# EasyEDA Pro project Drone.eprj, schematic Schematic1, sheet 1 of 9

## Sheets
1 SoC: Board Name: Board1; Create Date: 2025-04-25; Page Name: SoC; Project Name: Drone; Schematic Name: Schematic1; Update Date: 2025-08-30; Company: 嘉立创EDA; Page Size: A4; Version: V1.0
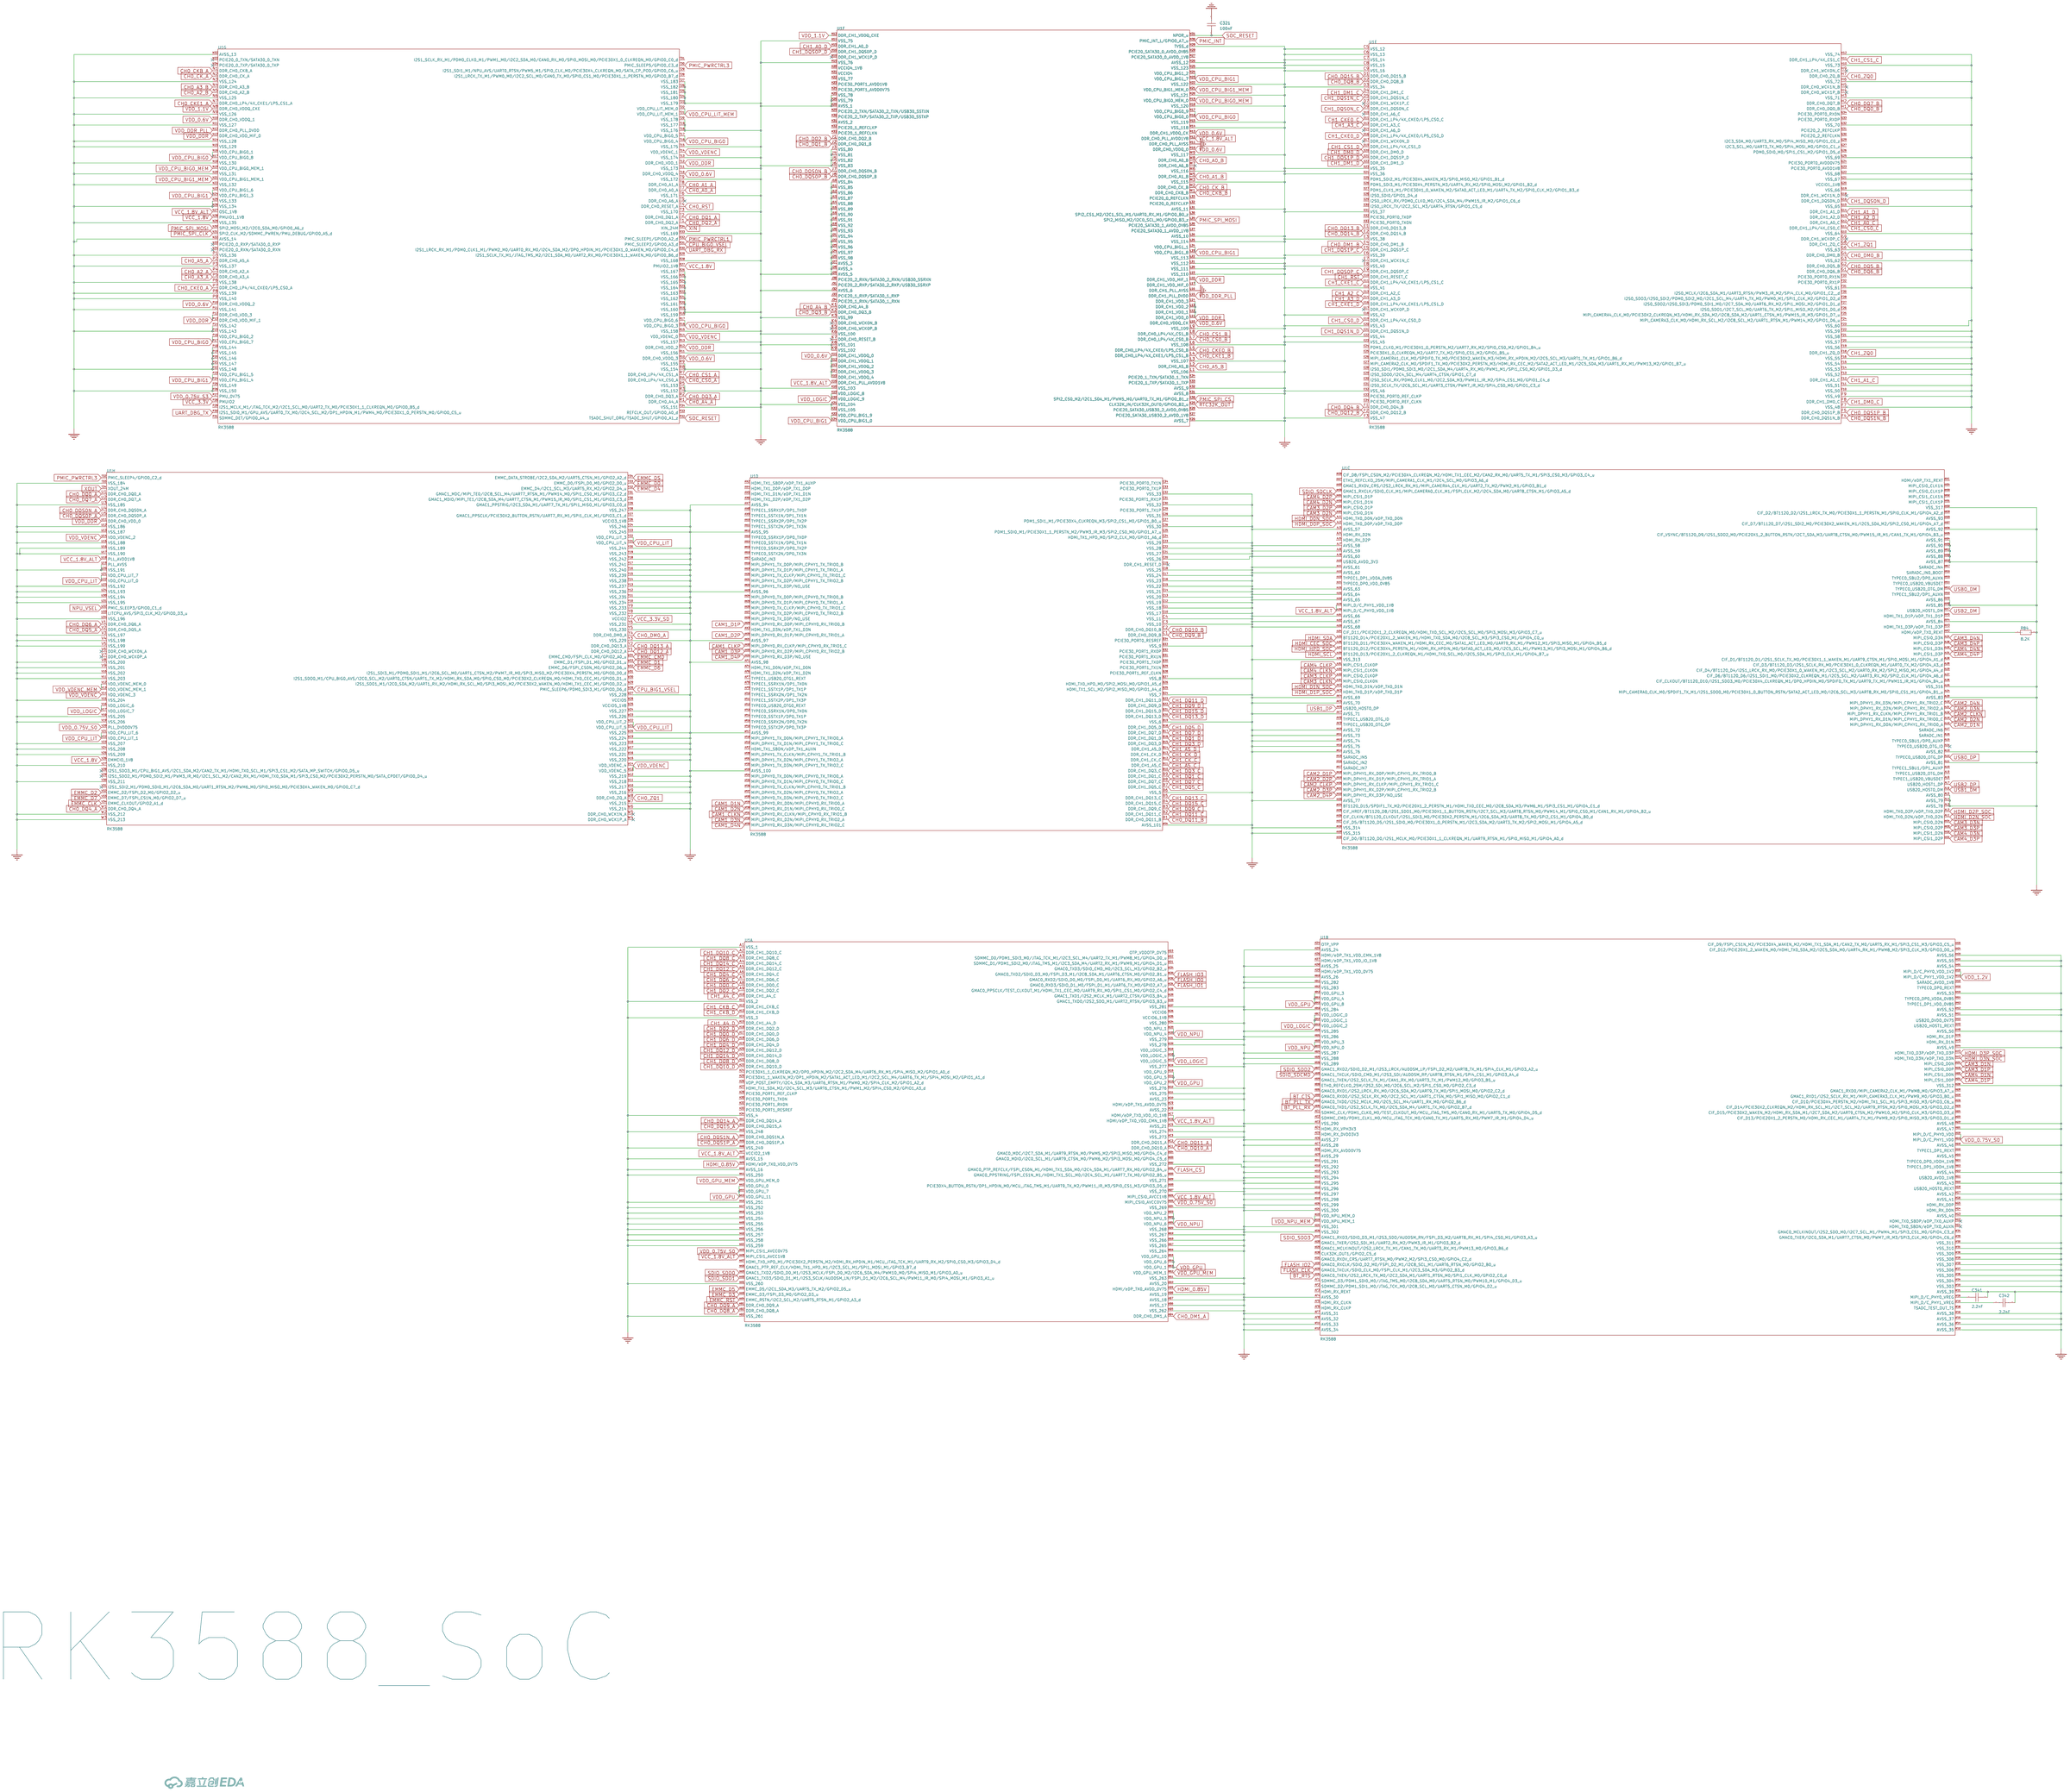
[diagram p0: SoC]

## Parts
C321  100nF  [C0201]
C341  2.2nF  [C0201]
C342  2.2nF  [C0201]
R84  8.2K  [R0603]
U1  RK3588  [FCBGA-1088_L23.0-W23.0-P0.65-TL_RK3588]  (sections 1,2,3,4,5,6,7,8)

## Library data of the parts
C321 = GRM033R61E104KE14D: LCSC Part Name: 100nF ±10% 25V; Supplier Part: C76939; Manufacturer: muRata(村田); Supplier Footprint: 0201; JLCPCB Part Class: Extended Part; Datasheet: https://atta.szlcsc.com/upload/public/pdf/source/20180307/C76939_15204091018551407727.pdf; Supplier: LCSC; Tolerance: ±10%; Voltage Rating: 25V; Temperature Coefficient: X5R
C341 C342 = CGA0201X7R222K500ET: LCSC Part Name: 2.2nF ±10% 50V; Supplier Part: C36911340; Manufacturer: HRE(芯声); Supplier Footprint: 0201; JLCPCB Part Class: Extended Part; Datasheet: https://atta.szlcsc.com/upload/public/pdf/source/20240730/354D3134AC94A21D1BE6B583FF1630D9.pdf; Supplier: LCSC; Tolerance: ±10%; Voltage Rating: 50V; Temperature Coefficient: X7R
R84 = Res_0603: Supplier Footprint: 0603
U1 = RK3588_C5156490: Supplier Part: C5156490; Manufacturer: Rockchip(瑞芯微); Supplier Footprint: BGA-1088; JLCPCB Part Class: 扩展库; Datasheet: https://atta.szlcsc.com/upload/public/pdf/source/20230904/073C391AB0E7106E056B3401F034E8E7.pdf; Supplier: LCSC

## Nets
GND: C321.2 C341.2 C342.2 R84.2 U1.A1(VSS_1) U1.A11(VSS_2) U1.A14(VSS_3) U1.A34(VSS_4) U1.AA3(VSS_248) U1.AA6(VSS_249) U1.AA8(AVSS_15) U1.AA10(AVSS_16) U1.AA11(VSS_250) U1.AA16(VSS_251) U1.AA17(VSS_252) U1.AA18(VSS_253) U1.AA19(VSS_254) U1.AA20(VSS_255) U1.AA21(VSS_256) U1.AA22(VSS_257) U1.AA23(VSS_258) U1.AA24(VSS_259) U1.AA31(VSS_260) U1.AB3(VSS_261) U1.AB5(VSS_262) U1.AB6(AVSS_17) U1.AB7(AVSS_18) U1.AB8(AVSS_19) U1.AB10(AVSS_20) U1.AB11(VSS_263) U1.AB16(VSS_264) U1.AB17(VSS_265) U1.AB18(VSS_266) U1.AB19(VSS_267) U1.AB20(VSS_268) U1.AB24(VSS_269) U1.AB27(VSS_270) U1.AB29(VSS_271) U1.AB32(VSS_272) U1.AC3(VSS_273) U1.AC4(VSS_274) U1.AC5(AVSS_21) U1.AC8(AVSS_22) U1.AC10(AVSS_23) U1.AC11(VSS_275) U1.AC12(VSS_276) U1.AC16(VSS_277) U1.AC20(VSS_278) U1.AC21(VSS_279) U1.AC24(VSS_280) U1.AC27(VSS_281) U1.AD5(AVSS_24) U1.AD8(AVSS_25) U1.AD10(AVSS_26) U1.AD11(VSS_282) U1.AD12(VSS_283) U1.AD16(VSS_284) U1.AD20(VSS_285) U1.AD21(VSS_286) U1.AD24(VSS_287) U1.AD25(VSS_288) U1.AD26(VSS_289) U1.AE3(VSS_290) U1.AE6(AVSS_27) U1.AE7(AVSS_28) U1.AE9(AVSS_29) U1.AE11(VSS_291) U1.AE12(VSS_292) U1.AE13(VSS_293) U1.AE14(VSS_294) U1.AE15(VSS_295) U1.AE16(VSS_296) U1.AE18(VSS_297) U1.AE19(VSS_298) U1.AE20(VSS_299) U1.AE21(VSS_300) U1.AE24(VSS_301) U1.AE26(VSS_302) U1.AF4(AVSS_30) U1.AF7(AVSS_31) U1.AF8(AVSS_32) U1.AF11(AVSS_33) U1.AF12(AVSS_34) U1.AF13(AVSS_35) U1.AF14(AVSS_36) U1.AF15(AVSS_37) U1.AF16(AVSS_38) U1.AF21(AVSS_39) U1.AF22(VSS_303) U1.AF24(VSS_304) U1.AF25(VSS_305) U1.AF27(VSS_306) U1.AF28(VSS_307) U1.AF29(VSS_308) U1.AF30(VSS_309) U1.AF31(VSS_310) U1.AF32(VSS_311) U1.AG3(AVSS_40) U1.AG6(AVSS_41) U1.AG7(AVSS_42) U1.AG10(AVSS_43) U1.AG12(AVSS_44) U1.AG18(AVSS_46) U1.AG21(AVSS_47) U1.AG22(AVSS_48) U1.AG30(VSS_312) U1.AH4(AVSS_49) U1.AH8(AVSS_50) U1.AH11(AVSS_51) U1.AH12(AVSS_52) U1.AH15(AVSS_53) U1.AH21(AVSS_54) U1.AH22(AVSS_55) U1.AH23(AVSS_56) U1.AJ3(AVSS_57) U1.AJ7(AVSS_58) U1.AJ8(AVSS_59) U1.AJ9(AVSS_60) U1.AJ11(AVSS_61) U1.AJ12(AVSS_62) U1.AJ15(AVSS_63) U1.AJ16(AVSS_64) U1.AJ18(AVSS_65) U1.AJ21(AVSS_66) U1.AJ22(AVSS_67) U1.AJ23(AVSS_68) U1.AJ30(VSS_313) U1.AK4(AVSS_69) U1.AK5(AVSS_70) U1.AK7(AVSS_71) U1.AK10(AVSS_72) U1.AK11(AVSS_73) U1.AK12(AVSS_74) U1.AK13(AVSS_75) U1.AK14(AVSS_76) U1.AK23(AVSS_77) U1.AK28(VSS_314) U1.AK29(VSS_315) U1.AL3(AVSS_78) U1.AL4(AVSS_79) U1.AL5(AVSS_80) U1.AL11(AVSS_81) U1.AL13(AVSS_82) U1.AL23(AVSS_83) U1.AL25(VSS_316) U1.AM4(AVSS_84) U1.AM8(AVSS_85) U1.AM9(AVSS_86) U1.AM18(AVSS_87) U1.AM20(AVSS_88) U1.AM22(AVSS_89) U1.AM23(AVSS_90) U1.AM24(AVSS_91) U1.AM26(AVSS_92) U1.AM30(VSS_317) U1.AN7(AVSS_94) U1.AN12(AVSS_95) U1.AN23(AVSS_96) U1.AN31(AVSS_97) U1.AP1(AVSS_98) U1.AP17(AVSS_99) U1.AP23(AVSS_100) U1.AP34(AVSS_101) U1.B6(VSS_5) U1.B19(VSS_6) U1.B24(VSS_7) U1.B27(VSS_8) U1.B33(VSS_9) U1.C3(VSS_10) U1.C4(VSS_11) U1.C5(VSS_12) U1.C6(VSS_13) U1.C7(VSS_14) U1.C8(VSS_15) U1.C9(VSS_16) U1.C10(VSS_17) U1.C11(VSS_18) U1.C12(VSS_19) U1.C13(VSS_20) U1.C14(VSS_21) U1.C15(VSS_22) U1.C16(VSS_23) U1.C17(VSS_24) U1.C18(VSS_25) U1.C20(VSS_26) U1.C21(VSS_27) U1.C22(VSS_28) U1.C23(VSS_29) U1.C26(VSS_30) U1.C28(VSS_31) U1.C30(VSS_32) U1.C32(VSS_33) U1.D3(VSS_34) U1.D23(VSS_35) U1.D24(VSS_36) U1.D31(VSS_37) U1.E3(VSS_38) U1.E6(VSS_39) U1.E8(VSS_40) U1.E12(VSS_41) U1.E18(VSS_42) U1.E20(VSS_43) U1.E22(VSS_44) U1.E23(VSS_45) U1.E32(VSS_46) U1.F3(VSS_47) U1.F7(VSS_48) U1.F9(VSS_49) U1.F10(VSS_50) U1.F11(VSS_51) U1.F13(VSS_52) U1.F14(VSS_53) U1.F15(VSS_54) U1.F16(VSS_55) U1.F19(VSS_56) U1.F20(VSS_57) U1.F21(VSS_58) U1.F22(VSS_59) U1.F23(VSS_60) U1.F31(VSS_61) U1.G3(VSS_62) U1.G6(VSS_63) U1.G10(VSS_64) U1.G15(VSS_65) U1.G19(VSS_66) U1.G21(VSS_67) U1.G22(VSS_68) U1.G25(VSS_69) U1.G32(VSS_70) U1.H3(VSS_71) U1.H6(VSS_72) U1.H10(VSS_73) U1.H12(VSS_74) U1.H14(VSS_75) U1.H19(VSS_76) U1.H25(VSS_78) U1.H26(VSS_79) U1.H28(AVSS_1) U1.J3(VSS_80) U1.J4(VSS_81) U1.J5(VSS_82) U1.J6(VSS_83) U1.J10(VSS_84) U1.J11(VSS_85) U1.J12(VSS_86) U1.J13(VSS_87) U1.J14(VSS_88) U1.J15(VSS_89) U1.J16(VSS_90) U1.J18(VSS_91) U1.J19(VSS_92) U1.J20(VSS_93) U1.J21(VSS_94) U1.J22(VSS_95) U1.J23(VSS_96) U1.J24(VSS_97) U1.J25(VSS_98) U1.J27(AVSS_3) U1.J28(AVSS_4) U1.J29(AVSS_5) U1.J32(AVSS_6) U1.K3(VSS_99) U1.K6(VSS_100) U1.K8(VSS_101) U1.K9(VSS_102) U1.K18(VSS_103) U1.K21(VSS_104) U1.K22(VSS_105) U1.K26(AVSS_7) U1.K31(AVSS_8) U1.K32(AVSS_9) U1.L1(VSS_106) U1.L3(VSS_107) U1.L6(VSS_108) U1.L9(VSS_109) U1.L16(DDR_CH1_PLL_AVSS) U1.L19(VSS_110) U1.L20(VSS_111) U1.L21(VSS_112) U1.L22(VSS_113) U1.L25(VSS_114) U1.L26(AVSS_10) U1.L31(AVSS_11) U1.M3(VSS_115) U1.M6(VSS_116) U1.M9(VSS_117) U1.M11(DDR_CH0_PLL_AVSS) U1.M14(VSS_118) U1.M15(VSS_119) U1.M18(VSS_120) U1.M20(VSS_121) U1.M22(VSS_122) U1.M25(VSS_123) U1.M26(AVSS_12) U1.M29(TVSS_d) U1.M32(AVSS_13) U1.N3(VSS_124) U1.N6(VSS_125) U1.N9(VSS_126) U1.N11(VSS_127) U1.N14(VSS_128) U1.N15(VSS_129) U1.N18(VSS_130) U1.N20(VSS_131) U1.N22(VSS_132) U1.N25(VSS_133) U1.N26(VSS_134) U1.N29(VSS_135) U1.N32(AVSS_14) U1.P1(VSS_136) U1.P3(VSS_137) U1.P6(VSS_138) U1.P8(VSS_139) U1.P9(VSS_140) U1.P11(VSS_141) U1.P14(VSS_142) U1.P15(VSS_143) U1.P18(VSS_144) U1.P19(VSS_145) U1.P20(VSS_146) U1.P21(VSS_147) U1.P22(VSS_148) U1.P25(VSS_149) U1.P26(VSS_150) U1.P34(VSS_151) U1.R3(VSS_152) U1.R5(VSS_153) U1.R8(VSS_154) U1.R9(VSS_155) U1.R11(VSS_156) U1.R13(VSS_157) U1.R15(VSS_158) U1.R18(VSS_159) U1.R19(VSS_160) U1.R20(VSS_161) U1.R21(VSS_162) U1.R22(VSS_163) U1.R23(VSS_164) U1.R24(VSS_165) U1.R25(VSS_166) U1.R26(VSS_167) U1.R28(VSS_168) U1.R33(VSS_169) U1.T3(VSS_170) U1.T6(VSS_171) U1.T9(VSS_172) U1.T11(VSS_173) U1.T13(VSS_174) U1.T15(VSS_175) U1.T18(VSS_176) U1.T19(VSS_177) U1.T20(VSS_178) U1.T23(VSS_179) U1.T24(VSS_180) U1.T25(VSS_181) U1.T26(VSS_182) U1.T27(VSS_183) U1.T33(VSS_184) U1.U3(VSS_185) U1.U12(VSS_186) U1.U13(VSS_187) U1.U15(VSS_188) U1.U16(VSS_189) U1.U17(VSS_190) U1.U19(PLL_AVSS) U1.U20(VSS_191) U1.U23(VSS_192) U1.U24(VSS_193) U1.U30(VSS_194) U1.U31(VSS_195) U1.U34(VSS_196) U1.V3(VSS_197) U1.V4(VSS_198) U1.V5(VSS_199) U1.V8(VSS_200) U1.V9(VSS_201) U1.V10(VSS_202) U1.V11(VSS_203) U1.V15(VSS_204) U1.V18(VSS_205) U1.V19(VSS_206) U1.V23(VSS_207) U1.V24(VSS_208) U1.V25(VSS_209) U1.V27(VSS_210) U1.V30(VSS_211) U1.W2(VSS_212) U1.W3(VSS_213) U1.W6(VSS_214) U1.W7(VSS_215) U1.W9(VSS_216) U1.W10(VSS_217) U1.W11(VSS_218) U1.W12(VSS_219) U1.W15(VSS_220) U1.W16(VSS_221) U1.W17(VSS_222) U1.W18(VSS_223) U1.W19(VSS_224) U1.W20(VSS_225) U1.W23(VSS_226) U1.W24(VSS_227) U1.W27(VSS_228) U1.Y3(VSS_229) U1.Y5(VSS_230) U1.Y6(VSS_231) U1.Y8(VSS_232) U1.Y9(VSS_233) U1.Y10(VSS_234) U1.Y11(VSS_235) U1.Y12(VSS_236) U1.Y13(VSS_237) U1.Y14(VSS_238) U1.Y15(VSS_239) U1.Y16(VSS_240) U1.Y17(VSS_241) U1.Y18(VSS_242) U1.Y19(VSS_243) U1.Y20(VSS_244) U1.Y23(VSS_245) U1.Y24(VSS_246) U1.Y28(VSS_247) ; also on sheet 2 3 4 5 6 7 8 9
VCC_1.8V: U1.N28(PMUIO1_1V8) U1.R27(PMUIO2_1V8) U1.V26(EMMCIO_1V8) ; also on sheet 2 4 5 6
VCC_1.8V_ALT: U1.AA7(VCCIO2_1V8) U1.AA26(MIPI_CSI1_AVCC1V8) U1.AB26(MIPI_CSI0_AVCC1V8) U1.AC6(HDMI/eDP_TX0_VDD_CMN_1V8) U1.AC7(HDMI/eDP_TX0_VDD_IO_1V8) U1.AJ19(MIPI_D/C_PHY1_VDD_1V8) U1.AJ20(MIPI_D/C_PHY0_VDD_1V8) U1.K16(DDR_CH1_PLL_AVDD1V8) U1.M12(DDR_CH0_PLL_AVDD1V8) U1.N27(OSC_1V8) U1.U18(PLL_AVDD1V8) ; also on sheet 4 5 9
VCC_3.3V: U1.P28(PMUIO2) ; also on sheet 2 4 7 8
VCC_3.3V_SD: U1.Y7(VCCIO2) ; also on sheet 4
VDD_0.6V: U1.K11(DDR_CH1_VDDQ_0) U1.K12(DDR_CH1_VDDQ_1) U1.K13(DDR_CH1_VDDQ_2) U1.K14(DDR_CH1_VDDQ_3) U1.K15(DDR_CH1_VDDQ_4) U1.L10(DDR_CH0_VDDQ_CK) U1.M10(DDR_CH0_VDDQ_0) U1.M13(DDR_CH1_VDDQ_CK) U1.N10(DDR_CH0_VDDQ_1) U1.P10(DDR_CH0_VDDQ_2) U1.R10(DDR_CH0_VDDQ_3) U1.T10(DDR_CH0_VDDQ_4) ; also on sheet 2 4 5
VDD_0.75V_S0: U1.AA25(MIPI_CSI1_AVCC0V75) U1.AB25(MIPI_CSI0_AVCC0V75) U1.AG19(MIPI_D/C_PHY1_VDD) U1.AG20(MIPI_D/C_PHY0_VDD) U1.V20(PLL_DVDD0V75) ; also on sheet 4 5
VDD_0.75V_S3: U1.P27(PMU_0V75) ; also on sheet 4 5
VDD_1.1V: U1.H13(DDR_CH1_VDDQ_CKE) U1.N8(DDR_CH0_VDDQ_CKE) ; also on sheet 2 4 5
VDD_1.2V: U1.AH19(MIPI_D/C_PHY1_VDD_1V2) U1.AH20(MIPI_D/C_PHY0_VDD_1V2) ; also on sheet 4 5
VDD_CPU_BIG0: U1.M16(VDD_CPU_BIG0_0) U1.M17(VDD_CPU_BIG0_9) U1.N16(VDD_CPU_BIG0_1) U1.N17(VDD_CPU_BIG0_8) U1.P16(VDD_CPU_BIG0_2) U1.P17(VDD_CPU_BIG0_7) U1.R16(VDD_CPU_BIG0_3) U1.R17(VDD_CPU_BIG0_6) U1.T16(VDD_CPU_BIG0_4) U1.T17(VDD_CPU_BIG0_5) ; also on sheet 4 5
VDD_CPU_BIG0_MEM: U1.M19(VDD_CPU_BIG0_MEM_0) U1.N19(VDD_CPU_BIG0_MEM_1) ; also on sheet 5
VDD_CPU_BIG1: U1.K23(VDD_CPU_BIG1_9) U1.K24(VDD_CPU_BIG1_0) U1.L23(VDD_CPU_BIG1_8) U1.L24(VDD_CPU_BIG1_1) U1.M23(VDD_CPU_BIG1_7) U1.M24(VDD_CPU_BIG1_2) U1.N23(VDD_CPU_BIG1_6) U1.N24(VDD_CPU_BIG1_3) U1.P23(VDD_CPU_BIG1_5) U1.P24(VDD_CPU_BIG1_4) ; also on sheet 4 5
VDD_CPU_BIG1_MEM: U1.M21(VDD_CPU_BIG1_MEM_0) U1.N21(VDD_CPU_BIG1_MEM_1) ; also on sheet 5
VDD_CPU_LIT: U1.U21(VDD_CPU_LIT_7) U1.U22(VDD_CPU_LIT_0) U1.V21(VDD_CPU_LIT_6) U1.V22(VDD_CPU_LIT_1) U1.W21(VDD_CPU_LIT_5) U1.W22(VDD_CPU_LIT_2) U1.Y21(VDD_CPU_LIT_4) U1.Y22(VDD_CPU_LIT_3) ; also on sheet 4 5
VDD_CPU_LIT_MEM: U1.T21(VDD_CPU_LIT_MEM_1) U1.T22(VDD_CPU_LIT_MEM_0) ; also on sheet 5
VDD_DDR: U1.L11(DDR_CH1_VDD_0) U1.L12(DDR_CH1_VDD_1) U1.L13(DDR_CH1_VDD_2) U1.L14(DDR_CH1_VDD_3) U1.L17(DDR_CH1_VDD_MIF_0) U1.L18(DDR_CH1_VDD_MIF_1) U1.N13(DDR_CH0_VDD_MIF_0) U1.P12(DDR_CH0_VDD_3) U1.P13(DDR_CH0_VDD_MIF_1) U1.R12(DDR_CH0_VDD_2) U1.T12(DDR_CH0_VDD_1) U1.U11(DDR_CH0_VDD_0) ; also on sheet 4 5
VDD_DDR_PLL: U1.L15(DDR_CH1_PLL_DVDD) U1.N12(DDR_CH0_PLL_DVDD) ; also on sheet 4 5
VDD_GPU: U1.AA13(VDD_GPU_0) U1.AA14(VDD_GPU_7) U1.AA15(VDD_GPU_11) U1.AB13(VDD_GPU_1) U1.AB14(VDD_GPU_6) U1.AB15(VDD_GPU_10) U1.AC13(VDD_GPU_2) U1.AC14(VDD_GPU_5) U1.AC15(VDD_GPU_9) U1.AD13(VDD_GPU_3) U1.AD14(VDD_GPU_4) U1.AD15(VDD_GPU_8) ; also on sheet 4 5
VDD_GPU_MEM: U1.AA12(VDD_GPU_MEM_0) U1.AB12(VDD_GPU_MEM_1) ; also on sheet 5
VDD_LOGIC: U1.AC17(VDD_LOGIC_5) U1.AC18(VDD_LOGIC_4) U1.AC19(VDD_LOGIC_3) U1.AD17(VDD_LOGIC_0) U1.AD18(VDD_LOGIC_1) U1.AD19(VDD_LOGIC_2) U1.K19(VDD_LOGIC_8) U1.K20(VDD_LOGIC_9) U1.V16(VDD_LOGIC_6) U1.V17(VDD_LOGIC_7) ; also on sheet 4 5
VDD_NPU: U1.AB21(VDD_NPU_6) U1.AB22(VDD_NPU_5) U1.AB23(VDD_NPU_2) U1.AC22(VDD_NPU_4) U1.AC23(VDD_NPU_1) U1.AD22(VDD_NPU_3) U1.AD23(VDD_NPU_0) ; also on sheet 4 5
VDD_NPU_MEM: U1.AE22(VDD_NPU_MEM_0) U1.AE23(VDD_NPU_MEM_1) ; also on sheet 5
VDD_VDENC: U1.R14(VDD_VDENC_0) U1.T14(VDD_VDENC_1) U1.U14(VDD_VDENC_2) U1.V14(VDD_VDENC_3) U1.W13(VDD_VDENC_5) U1.W14(VDD_VDENC_4) ; also on sheet 4 5
VDD_VDENC_MEM: U1.V12(VDD_VDENC_MEM_0) U1.V13(VDD_VDENC_MEM_1) ; also on sheet 5
BT_CTS: U1.AD32(GMAC0_RXD0/I2S2_SCLK_RX_M0/I2C2_SCL_M1/UART1_CTSN_M0/SPI1_MISO_M0/GPIO2_C1_d) ; also on sheet 6
BT_PLL_RX: U1.AD34(GMAC0_TXD1/I2S2_SCLK_TX_M0/I2C5_SDA_M4/UART1_TX_M0/GPIO2_B7_d) ; also on sheet 6
BT_PLL_TX: U1.AD33(GMAC0_TXD0/I2S2_MCLK_M0/I2C5_SCL_M4/UART1_RX_M0/GPIO2_B6_d) ; also on sheet 6
BT_RTS: U1.AE34(GMAC0_TXEN/I2S2_LRCK_TX_M0/I2C2_SDA_M1/UART1_RTSN_M0/SPI1_CLK_M0/GPIO2_C0_d) ; also on sheet 6
CAM1_CLKN: U1.AP31(MIPI_DPHY0_RX_CLKN/MIPI_CPHY0_RX_TRIO1_B) ; also on sheet 8
CAM1_CLKP: U1.AN32(MIPI_DPHY0_RX_CLKP/MIPI_CPHY0_RX_TRIO1_C) ; also on sheet 8
CAM1_D1N: U1.AP29(MIPI_DPHY0_RX_D0N/MIPI_CPHY0_RX_TRIO0_A) ; also on sheet 8
CAM1_D1P: U1.AN29(MIPI_DPHY0_RX_D0P/MIPI_CPHY0_RX_TRIO0_B) ; also on sheet 8
CAM1_D2N: U1.AP30(MIPI_DPHY0_RX_D1N/MIPI_CPHY0_RX_TRIO0_C) ; also on sheet 8
CAM1_D2P: U1.AN30(MIPI_DPHY0_RX_D1P/MIPI_CPHY0_RX_TRIO1_A) ; also on sheet 8
CAM1_D3N: U1.AP32(MIPI_DPHY0_RX_D2N/MIPI_CPHY0_RX_TRIO2_A) ; also on sheet 8
CAM1_D3P: U1.AN33(MIPI_DPHY0_RX_D2P/MIPI_CPHY0_RX_TRIO2_B) ; also on sheet 8
CAM1_D4N: U1.AP33(MIPI_DPHY0_RX_D3N/MIPI_CPHY0_RX_TRIO2_C) ; also on sheet 8
CAM1_D4P: U1.AN34(MIPI_DPHY0_RX_D3P/NO_USE) ; also on sheet 8
CAM2_CLKN: U1.AL20(MIPI_DPHY1_RX_CLKN/MIPI_CPHY1_RX_TRIO1_B) ; also on sheet 8
CAM2_CLKP: U1.AK20(MIPI_DPHY1_RX_CLKP/MIPI_CPHY1_RX_TRIO1_C) ; also on sheet 8
CAM2_D1N: U1.AL18(MIPI_DPHY1_RX_D0N/MIPI_CPHY1_RX_TRIO0_A) ; also on sheet 8
CAM2_D1P: U1.AK18(MIPI_DPHY1_RX_D0P/MIPI_CPHY1_RX_TRIO0_B) ; also on sheet 8
CAM2_D2N: U1.AL19(MIPI_DPHY1_RX_D1N/MIPI_CPHY1_RX_TRIO0_C) ; also on sheet 8
CAM2_D2P: U1.AK19(MIPI_DPHY1_RX_D1P/MIPI_CPHY1_RX_TRIO1_A) ; also on sheet 8
CAM2_D3N: U1.AL21(MIPI_DPHY1_RX_D2N/MIPI_CPHY1_RX_TRIO2_A) ; also on sheet 8
CAM2_D3P: U1.AK21(MIPI_DPHY1_RX_D2P/MIPI_CPHY1_RX_TRIO2_B) ; also on sheet 8
CAM2_D4N: U1.AL22(MIPI_DPHY1_RX_D3N/MIPI_CPHY1_RX_TRIO2_C) ; also on sheet 8
CAM2_D4P: U1.AK22(MIPI_DPHY1_RX_D3P/NO_USE) ; also on sheet 8
CAM3_CLKN: U1.AJ34(MIPI_CSI0_CLK0N) ; also on sheet 8
CAM3_CLKP: U1.AJ33(MIPI_CSI0_CLK0P) ; also on sheet 8
CAM3_D1N: U1.AG34(MIPI_CSI0_D0N) ; also on sheet 8
CAM3_D1P: U1.AG33(MIPI_CSI0_D0P) ; also on sheet 8
CAM3_D2N: U1.AH34(MIPI_CSI0_D1N) ; also on sheet 8
CAM3_D2P: U1.AH33(MIPI_CSI0_D1P) ; also on sheet 8
CAM3_D3N: U1.AK34(MIPI_CSI0_D2N) ; also on sheet 8
CAM3_D3P: U1.AK33(MIPI_CSI0_D2P) ; also on sheet 8
CAM3_D4N: U1.AL34(MIPI_CSI0_D3N) ; also on sheet 8
CAM3_D4P: U1.AL33(MIPI_CSI0_D3P) ; also on sheet 8
CAM4_CLKN: U1.AJ32(MIPI_CSI1_CLK0N) ; also on sheet 8
CAM4_CLKP: U1.AJ31(MIPI_CSI1_CLK0P) ; also on sheet 8
CAM4_D1N: U1.AG32(MIPI_CSI1_D0N) ; also on sheet 8
CAM4_D1P: U1.AG31(MIPI_CSI1_D0P) ; also on sheet 8
CAM4_D2N: U1.AH32(MIPI_CSI1_D1N) ; also on sheet 8
CAM4_D2P: U1.AH31(MIPI_CSI1_D1P) ; also on sheet 8
CAM4_D3N: U1.AK32(MIPI_CSI1_D2N) ; also on sheet 8
CAM4_D3P: U1.AK31(MIPI_CSI1_D2P) ; also on sheet 8
CAM4_D4N: U1.AL32(MIPI_CSI1_D3N) ; also on sheet 8
CAM4_D4P: U1.AL31(MIPI_CSI1_D3P) ; also on sheet 8
CH0_A0_A: U1.T7(DDR_CH0_A0_A) ; also on sheet 2
CH0_A0_B: U1.M8(DDR_CH0_A0_B) ; also on sheet 2
CH0_A1_A: U1.T8(DDR_CH0_A1_A) ; also on sheet 2
CH0_A1_B: U1.M5(DDR_CH0_A1_B) ; also on sheet 2
CH0_A2_A: U1.P4(DDR_CH0_A2_A) ; also on sheet 2
CH0_A2_B: U1.N5(DDR_CH0_A2_B) ; also on sheet 2
CH0_A3_A: U1.P5(DDR_CH0_A3_A) ; also on sheet 2
CH0_A3_B: U1.N4(DDR_CH0_A3_B) ; also on sheet 2
CH0_A4_A: U1.R1(DDR_CH0_A4_A) ; also on sheet 2
CH0_A4_B: U1.K1(DDR_CH0_A4_B) ; also on sheet 2
CH0_A5_A: U1.P2(DDR_CH0_A5_A) ; also on sheet 2
CH0_A5_B: U1.L2(DDR_CH0_A5_B) ; also on sheet 2
CH0_CK_A: U1.N2(DDR_CH0_CK_A) ; also on sheet 2
CH0_CK_B: U1.M2(DDR_CH0_CK_B) ; also on sheet 2
CH0_CKB_A: U1.N1(DDR_CH0_CKB_A) ; also on sheet 2
CH0_CKB_B: U1.M1(DDR_CH0_CKB_B) ; also on sheet 2
CH0_CKE0_A: U1.P7(DDR_CH0_LP4/4X_CKE0/LP5_CS0_A) ; also on sheet 2
CH0_CKE0_B: U1.L5(DDR_CH0_LP4/4X_CKE0/LP5_CS0_B) ; also on sheet 2
CH0_CKE1_A: U1.N7(DDR_CH0_LP4/4X_CKE1/LP5_CS1_A) ; also on sheet 2
CH0_CKE1_B: U1.L4(DDR_CH0_LP4/4X_CKE1/LP5_CS1_B) ; also on sheet 2
CH0_CS0_A: U1.R6(DDR_CH0_LP4/4X_CS0_A) ; also on sheet 2
CH0_CS0_B: U1.L7(DDR_CH0_LP4/4X_CS0_B) ; also on sheet 2
CH0_CS1_A: U1.R7(DDR_CH0_LP4/4X_CS1_A) ; also on sheet 2
CH0_CS1_B: U1.L8(DDR_CH0_LP4/4X_CS1_B) ; also on sheet 2
CH0_DM0_A: U1.Y4(DDR_CH0_DM0_A) ; also on sheet 2
CH0_DM0_B: U1.G4(DDR_CH0_DM0_B) ; also on sheet 2
CH0_DM1_A: U1.AB4(DDR_CH0_DM1_A) ; also on sheet 2
CH0_DM1_B: U1.E4(DDR_CH0_DM1_B) ; also on sheet 2
CH0_DQ0_A: U1.U1(DDR_CH0_DQ0_A) ; also on sheet 2
CH0_DQ0_B: U1.H1(DDR_CH0_DQ0_B) ; also on sheet 2
CH0_DQ1_A: U1.T2(DDR_CH0_DQ1_A) ; also on sheet 2
CH0_DQ1_B: U1.J2(DDR_CH0_DQ1_B) ; also on sheet 2
CH0_DQ2_A: U1.T1(DDR_CH0_DQ2_A) ; also on sheet 2
CH0_DQ2_B: U1.J1(DDR_CH0_DQ2_B) ; also on sheet 2
CH0_DQ3_A: U1.R2(DDR_CH0_DQ3_A) ; also on sheet 2
CH0_DQ3_B: U1.K2(DDR_CH0_DQ3_B) ; also on sheet 2
CH0_DQ4_A: U1.W1(DDR_CH0_DQ4_A) ; also on sheet 2
CH0_DQ4_B: U1.F1(DDR_CH0_DQ4_B) ; also on sheet 2
CH0_DQ5_A: U1.V2(DDR_CH0_DQ5_A) ; also on sheet 2
CH0_DQ5_B: U1.G2(DDR_CH0_DQ5_B) ; also on sheet 2
CH0_DQ6_A: U1.V1(DDR_CH0_DQ6_A) ; also on sheet 2
CH0_DQ6_B: U1.G1(DDR_CH0_DQ6_B) ; also on sheet 2
CH0_DQ7_A: U1.U2(DDR_CH0_DQ7_A) ; also on sheet 2
CH0_DQ7_B: U1.H2(DDR_CH0_DQ7_B) ; also on sheet 2
CH0_DQ8_A: U1.AB2(DDR_CH0_DQ8_A) ; also on sheet 2
CH0_DQ8_B: U1.D2(DDR_CH0_DQ8_B) ; also on sheet 2
CH0_DQ9_A: U1.AB1(DDR_CH0_DQ9_A) ; also on sheet 2
CH0_DQ9_B: U1.C1(DDR_CH0_DQ9_B) ; also on sheet 2
CH0_DQ10_A: U1.AC1(DDR_CH0_DQ10_A) ; also on sheet 2
CH0_DQ10_B: U1.C2(DDR_CH0_DQ10_B) ; also on sheet 2
CH0_DQ11_A: U1.AC2(DDR_CH0_DQ11_A) ; also on sheet 2
CH0_DQ11_B: U1.B1(DDR_CH0_DQ11_B) ; also on sheet 2
CH0_DQ12_A: U1.Y1(DDR_CH0_DQ12_A) ; also on sheet 2
CH0_DQ12_B: U1.F2(DDR_CH0_DQ12_B) ; also on sheet 2
CH0_DQ13_A: U1.Y2(DDR_CH0_DQ13_A) ; also on sheet 2
CH0_DQ13_B: U1.E1(DDR_CH0_DQ13_B) ; also on sheet 2
CH0_DQ14_A: U1.AA1(DDR_CH0_DQ14_A) ; also on sheet 2
CH0_DQ14_B: U1.E2(DDR_CH0_DQ14_B) ; also on sheet 2
CH0_DQ15_A: U1.AA2(DDR_CH0_DQ15_A) ; also on sheet 2
CH0_DQ15_B: U1.D1(DDR_CH0_DQ15_B) ; also on sheet 2
CH0_DQS0N_A: U1.U4(DDR_CH0_DQS0N_A) ; also on sheet 2
CH0_DQS0N_B: U1.J7(DDR_CH0_DQS0N_B) ; also on sheet 2
CH0_DQS0P_A: U1.U5(DDR_CH0_DQS0P_A) ; also on sheet 2
CH0_DQS0P_B: U1.J8(DDR_CH0_DQS0P_B) ; also on sheet 2
CH0_DQS1N_A: U1.AA4(DDR_CH0_DQS1N_A) ; also on sheet 2
CH0_DQS1N_B: U1.F4(DDR_CH0_DQS1N_B) ; also on sheet 2
CH0_DQS1P_A: U1.AA5(DDR_CH0_DQS1P_A) ; also on sheet 2
CH0_DQS1P_B: U1.F5(DDR_CH0_DQS1P_B) ; also on sheet 2
CH0_RST: U1.T4(DDR_CH0_RESET_A) ; also on sheet 2
CH0_ZQ0: U1.H7(DDR_CH0_ZQ_B) ; also on sheet 2
CH0_ZQ1: U1.W8(DDR_CH0_ZQ_A) ; also on sheet 2
CH1_A0_C: U1.G12(DDR_CH1_A0_C) ; also on sheet 2
CH1_A0_D: U1.H15(DDR_CH1_A0_D) ; also on sheet 2
CH1_A1_C: U1.F12(DDR_CH1_A1_C) ; also on sheet 2
CH1_A1_D: U1.G14(DDR_CH1_A1_D) ; also on sheet 2
CH1_A2_C: U1.E13(DDR_CH1_A2_C) ; also on sheet 2
CH1_A2_D: U1.G13(DDR_CH1_A2_D) ; also on sheet 2
CH1_A3_C: U1.D13(DDR_CH1_A3_C) ; also on sheet 2
CH1_A3_D: U1.E14(DDR_CH1_A3_D) ; also on sheet 2
CH1_A4_C: U1.A10(DDR_CH1_A4_C) ; also on sheet 2
CH1_A4_D: U1.A15(DDR_CH1_A4_D) ; also on sheet 2
CH1_A5_C: U1.B11(DDR_CH1_A5_C) ; also on sheet 2
CH1_A5_D: U1.B14(DDR_CH1_A5_D) ; also on sheet 2
CH1_CK_C: U1.B12(DDR_CH1_CK_C) ; also on sheet 2
CH1_CK_D: U1.B13(DDR_CH1_CK_D) ; also on sheet 2
CH1_CKB_C: U1.A12(DDR_CH1_CKB_C) ; also on sheet 2
CH1_CKB_D: U1.A13(DDR_CH1_CKB_D) ; also on sheet 2
CH1_CKE0_C: U1.D11(DDR_CH1_LP4/4X_CKE0/LP5_CS0_C) ; also on sheet 2
CH1_CKE0_D: U1.D16(DDR_CH1_LP4/4X_CKE0/LP5_CS0_D) ; also on sheet 2
CH1_CKE1_C: U1.E11(DDR_CH1_LP4/4X_CKE1/LP5_CS1_C) ; also on sheet 2
CH1_CKE1_D: U1.E16(DDR_CH1_LP4/4X_CKE1/LP5_CS1_D) ; also on sheet 2
CH1_CS0_C: U1.G11(DDR_CH1_LP4/4X_CS0_C) ; also on sheet 2
CH1_CS0_D: U1.E19(DDR_CH1_LP4/4X_CS0_D) ; also on sheet 2
CH1_CS1_C: U1.H11(DDR_CH1_LP4/4X_CS1_C) ; also on sheet 2
CH1_CS1_D: U1.D19(DDR_CH1_LP4/4X_CS1_D) ; also on sheet 2
CH1_DM0_C: U1.F8(DDR_CH1_DM0_C) ; also on sheet 2
CH1_DM0_D: U1.D20(DDR_CH1_DM0_D) ; also on sheet 2
CH1_DM1_C: U1.D4(DDR_CH1_DM1_C) ; also on sheet 2
CH1_DM1_D: U1.D22(DDR_CH1_DM1_D) ; also on sheet 2
CH1_DQ0_C: U1.A8(DDR_CH1_DQ0_C) ; also on sheet 2
CH1_DQ0_D: U1.A17(DDR_CH1_DQ0_D) ; also on sheet 2
CH1_DQ1_C: U1.B9(DDR_CH1_DQ1_C) ; also on sheet 2
CH1_DQ1_D: U1.B16(DDR_CH1_DQ1_D) ; also on sheet 2
CH1_DQ2_C: U1.A9(DDR_CH1_DQ2_C) ; also on sheet 2
CH1_DQ2_D: U1.A16(DDR_CH1_DQ2_D) ; also on sheet 2
CH1_DQ3_C: U1.B10(DDR_CH1_DQ3_C) ; also on sheet 2
CH1_DQ3_D: U1.B15(DDR_CH1_DQ3_D) ; also on sheet 2
CH1_DQ4_C: U1.A6(DDR_CH1_DQ4_C) ; also on sheet 2
CH1_DQ4_D: U1.A19(DDR_CH1_DQ4_D) ; also on sheet 2
CH1_DQ5_C: U1.B7(DDR_CH1_DQ5_C) ; also on sheet 2
CH1_DQ5_D: U1.B18(DDR_CH1_DQ5_D) ; also on sheet 2
CH1_DQ6_C: U1.A7(DDR_CH1_DQ6_C) ; also on sheet 2
CH1_DQ6_D: U1.A18(DDR_CH1_DQ6_D) ; also on sheet 2
CH1_DQ7_C: U1.B8(DDR_CH1_DQ7_C) ; also on sheet 2
CH1_DQ7_D: U1.B17(DDR_CH1_DQ7_D) ; also on sheet 2
CH1_DQ8_C: U1.A3(DDR_CH1_DQ8_C) ; also on sheet 2
CH1_DQ8_D: U1.A22(DDR_CH1_DQ8_D) ; also on sheet 2
CH1_DQ9_C: U1.B3(DDR_CH1_DQ9_C) ; also on sheet 2
CH1_DQ9_D: U1.B22(DDR_CH1_DQ9_D) ; also on sheet 2
CH1_DQ10_C: U1.A2(DDR_CH1_DQ10_C) ; also on sheet 2
CH1_DQ10_D: U1.A23(DDR_CH1_DQ10_D) ; also on sheet 2
CH1_DQ11_C: U1.B2(DDR_CH1_DQ11_C) ; also on sheet 2
CH1_DQ11_D: U1.B23(DDR_CH1_DQ11_D) ; also on sheet 2
CH1_DQ12_C: U1.A5(DDR_CH1_DQ12_C) ; also on sheet 2
CH1_DQ12_D: U1.A20(DDR_CH1_DQ12_D) ; also on sheet 2
CH1_DQ13_C: U1.B5(DDR_CH1_DQ13_C) ; also on sheet 2
CH1_DQ13_D: U1.B20(DDR_CH1_DQ13_D) ; also on sheet 2
CH1_DQ14_C: U1.A4(DDR_CH1_DQ14_C) ; also on sheet 2
CH1_DQ14_D: U1.A21(DDR_CH1_DQ14_D) ; also on sheet 2
CH1_DQ15_C: U1.B4(DDR_CH1_DQ15_C) ; also on sheet 2
CH1_DQ15_D: U1.B21(DDR_CH1_DQ15_D) ; also on sheet 2
CH1_DQS0N_C: U1.D9(DDR_CH1_DQS0N_C) ; also on sheet 2
CH1_DQS0N_D: U1.G16(DDR_CH1_DQS0N_D) ; also on sheet 2
CH1_DQS0P_C: U1.E9(DDR_CH1_DQS0P_C) ; also on sheet 2
CH1_DQS0P_D: U1.H16(DDR_CH1_DQS0P_D) ; also on sheet 2
CH1_DQS1N_C: U1.D5(DDR_CH1_DQS1N_C) ; also on sheet 2
CH1_DQS1N_D: U1.E21(DDR_CH1_DQS1N_D) ; also on sheet 2
CH1_DQS1P_C: U1.E5(DDR_CH1_DQS1P_C) ; also on sheet 2
CH1_DQS1P_D: U1.D21(DDR_CH1_DQS1P_D) ; also on sheet 2
CH1_RST: U1.E10(DDR_CH1_RESET_C) ; also on sheet 2
CH1_ZQ0: U1.F18(DDR_CH1_ZQ_D) ; also on sheet 2
CH1_ZQ1: U1.G8(DDR_CH1_ZQ_C) ; also on sheet 2
CPU_BIG0_VSEL: U1.R31(PMIC_SLEEP2/GPIO0_A3_d) ; also on sheet 4
CPU_BIG1_VSEL: U1.W28(PMIC_SLEEP6/PDM0_SDI3_M1/GPIO0_D6_d) ; also on sheet 4
EMMC_CLK: U1.V34(EMMC_CLKOUT/GPIO2_A1_d) ; also on sheet 2
EMMC_CMD: U1.W34(EMMC_CMD/FSPI_CLK_M0/GPIO2_A0_u) ; also on sheet 2
EMMC_D0: U1.Y33(EMMC_D0/FSPI_D0_M0/GPIO2_D0_u) ; also on sheet 2
EMMC_D1: U1.W33(EMMC_D1/FSPI_D1_M0/GPIO2_D1_u) ; also on sheet 2
EMMC_D2: U1.V32(EMMC_D2/FSPI_D2_M0/GPIO2_D2_u) ; also on sheet 2
EMMC_D3: U1.AA33(EMMC_D3/FSPI_D3_M0/GPIO2_D3_u) ; also on sheet 2
EMMC_D4: U1.Y32(EMMC_D4/I2C1_SCL_M3/UART5_RX_M2/GPIO2_D4_u) ; also on sheet 2
EMMC_D5: U1.AA32(EMMC_D5/I2C1_SDA_M3/UART5_TX_M2/GPIO2_D5_u) ; also on sheet 2
EMMC_D6: U1.W32(EMMC_D6/FSPI_CS0N_M0/GPIO2_D6_u) ; also on sheet 2
EMMC_D7: U1.V33(EMMC_D7/FSPI_CS1N_M0/GPIO2_D7_u) ; also on sheet 2
EMMC_DS: U1.Y34(EMMC_DATA_STROBE/I2C2_SDA_M2/UART5_CTSN_M1/GPIO2_A2_d) ; also on sheet 2
EMMC_RST: U1.AA34(EMMC_RSTN/I2C2_SCL_M2/UART5_RTSN_M1/GPIO2_A3_d) ; also on sheet 2
FLASH_CLK: U1.AE33(GMAC0_TXCLK/SDIO_CLK_M0/FSPI_CLK_M1/I2C3_SDA_M3/GPIO2_B3_d) ; also on sheet 2
FLASH_CS: U1.AB31(GMAC0_PTP_REFCLK/FSPI_CS0N_M1/HDMI_TX1_SDA_M0/I2C4_SDA_M1/UART7_RX_M0/GPIO2_B4_u) ; also on sheet 2
FLASH_IO0: U1.AC32(GMAC0_RXD2/SDIO_D0_M0/FSPI_D0_M1/UART6_RX_M0/GPIO2_A6_u) ; also on sheet 2
FLASH_IO1: U1.AC31(GMAC0_RXD3/SDIO_D1_M0/FSPI_D1_M1/UART6_TX_M0/GPIO2_A7_u) ; also on sheet 2
FLASH_IO2: U1.AE32(GMAC0_RXCLK/SDIO_D2_M0/FSPI_D2_M1/I2C8_SCL_M1/UART6_RTSN_M0/GPIO2_B0_u) ; also on sheet 2
FLASH_IO3: U1.AC33(GMAC0_TXD2/SDIO_D3_M0/FSPI_D3_M1/I2C8_SDA_M1/UART6_CTSN_M0/GPIO2_B1_u) ; also on sheet 2
HDMI_0.85V: U1.AA9(HDMI/eDP_TX0_VDD_0V75) U1.AB9(HDMI/eDP_TX0_AVDD_0V75) ; also on sheet 4 5
HDMI_CEC_SOC: U1.AJ26(BT1120_D11/PCIE30X4_WAKEN_M1/HDMI_RX_CEC_M0/SATA1_ACT_LED_M0/UART9_RX_M1/PWM12_M1/SPI3_MISO_M1/GPIO4_B5_d) ; also on sheet 9
HDMI_D0N_SOC: U1.AJ1(HDMI_TX0_D0N/eDP_TX0_D0N) ; also on sheet 9
HDMI_D0P_SOC: U1.AJ2(HDMI_TX0_D0P/eDP_TX0_D0P) ; also on sheet 9
HDMI_D1N_SOC: U1.AK2(HDMI_TX0_D1N/eDP_TX0_D1N) ; also on sheet 9
HDMI_D1P_SOC: U1.AK3(HDMI_TX0_D1P/eDP_TX0_D1P) ; also on sheet 9
HDMI_D2N_SOC: U1.AL1(HDMI_TX0_D2N/eDP_TX0_D2N) ; also on sheet 9
HDMI_D2P_SOC: U1.AL2(HDMI_TX0_D2P/eDP_TX0_D2P) ; also on sheet 9
HDMI_D3N_SOC: U1.AH2(HDMI_TX0_D3N/eDP_TX0_D3N) ; also on sheet 9
HDMI_D3P_SOC: U1.AH3(HDMI_TX0_D3P/eDP_TX0_D3P) ; also on sheet 9
HDMI_HPD_SOC: U1.AJ27(BT1120_D12/PCIE30X4_PERSTN_M1/HDMI_RX_HPDIN_M0/SATA0_ACT_LED_M0/I2C5_SCL_M1/PWM13_M1/SPI3_MOSI_M1/GPIO4_B6_d) ; also on sheet 9
HDMI_SCL: U1.AJ28(BT1120_D13/PCIE20X1_2_CLKREQN_M1/HDMI_TX0_SCL_M0/I2C5_SDA_M1/SPI3_CLK_M1/GPIO4_B7_u) ; also on sheet 9
HDMI_SDA: U1.AJ25(BT1120_D14/PCIE20X1_2_WAKEN_M1/HDMI_TX0_SDA_M0/I2C8_SCL_M3/SPI3_CS0_M1/GPIO4_C0_u) ; also on sheet 9
NPU_VSEL: U1.U32(PMIC_SLEEP3/GPIO0_C1_d) ; also on sheet 4
PMIC_INT: U1.M30(PMIC_INT_L/GPIO0_A7_u) ; also on sheet 4
PMIC_PWRCTRL1: U1.R32(PMIC_SLEEP1/GPIO0_A2_d) ; also on sheet 4
PMIC_PWRCTRL3: U1.T30(PMIC_SLEEP5/GPIO0_C3_d) U1.T32(PMIC_SLEEP4/GPIO0_C2_d) ; also on sheet 4
PMIC_SPI_CLK: U1.N31(SPI2_CLK_M2/SDMMC_PWREN/PMU_DEBUG/GPIO0_A5_d) ; also on sheet 4
PMIC_SPI_CS: U1.K30(SPI2_CS0_M2/I2C1_SDA_M1/PWM5_M0/UART0_TX_M1/GPIO0_B1_z) ; also on sheet 4
PMIC_SPI_MOSI: U1.L29(SPI2_MISO_M2/I2C0_SCL_M0/GPIO0_B3_z) U1.N30(SPI2_MOSI_M2/I2C0_SDA_M0/GPIO0_A6_z) ; also on sheet 4
RTC32K_OUT: U1.K29(CLK32K_IN/CLK32K_OUT0/GPIO0_B2_u) ; also on sheet 3
SDIO_SDCLK: U1.AH30(GMAC1_RXCLK/SDIO_CLK_M1/MIPI_CAMERA0_CLK_M1/FSPI_CLK_M2/I2C4_SDA_M0/UART8_CTSN_M1/GPIO3_A5_d) ; also on sheet 6
SDIO_SDCMD: U1.AD28(GMAC1_TXCLK/SDIO_CMD_M1/I2S3_SDI/AUDDSM_RP/UART8_RTSN_M1/SPI4_CS1_M1/GPIO3_A4_d) ; also on sheet 6
SDIO_SDD0: U1.AA29(GMAC1_TXD2/SDIO_D0_M1/I2S3_MCLK/FSPI_D0_M2/I2C6_SDA_M4/PWM10_M0/SPI4_MISO_M1/GPIO3_A0_u) ; also on sheet 6
SDIO_SDD1: U1.AA30(GMAC1_TXD3/SDIO_D1_M1/I2S3_SCLK/AUDDSM_LN/FSPI_D1_M2/I2C6_SCL_M4/PWM11_IR_M0/SPI4_MOSI_M1/GPIO3_A1_u) ; also on sheet 6
SDIO_SDD2: U1.AD27(GMAC1_RXD2/SDIO_D2_M1/I2S3_LRCK/AUDDSM_LP/FSPI_D2_M2/UART8_TX_M1/SPI4_CLK_M1/GPIO3_A2_u) ; also on sheet 6
SDIO_SDD3: U1.AE27(GMAC1_RXD3/SDIO_D3_M1/I2S3_SDO/AUDDSM_RN/FSPI_D3_M2/UART8_RX_M1/SPI4_CS0_M1/GPIO3_A3_u) ; also on sheet 6
SOC_RESET: C321.1 U1.M31(NPOR_u) U1.P32(TSADC_SHUT_ORG/TSADC_SHUT/GPIO0_A1_z) ; also on sheet 4
UART_DBG_RX: U1.R30(I2S1_LRCK_RX_M1/PDM0_CLK1_M1/PWM2_M0/UART0_RX_M0/I2C4_SDA_M2/DP0_HPDIN_M1/PCIE30X1_0_WAKEN_M0/GPIO0_C4_d) ; also on sheet 8
UART_DBG_TX: U1.P30(I2S1_SDI0_M1/GPU_AVS/UART0_TX_M0/I2C4_SCL_M2/DP1_HPDIN_M1/PWM4_M0/PCIE30X1_0_PERSTN_M0/GPIO0_C5_u) ; also on sheet 8
USB0_DM: U1.AM12(TYPEC0_USB20_OTG_DM) ; also on sheet 9
USB0_DP: U1.AL12(TYPEC0_USB20_OTG_DP) ; also on sheet 9
USB1_DM: U1.AL6(USB20_HOST0_DM) ; also on sheet 9
USB1_DP: U1.AK6(USB20_HOST0_DP) ; also on sheet 9
USB2_DM: U1.AM7(USB20_HOST1_DM) ; also on sheet 9
USB2_DP: U1.AL7(USB20_HOST1_DP) ; also on sheet 9
XIN: U1.R34(XIN_24M) ; also on sheet 3
XOUT: U1.T34(XOUT_24M) ; also on sheet 3
$1N132094: C341.1 U1.AF20(MIPI_D/C_PHY0_VREG)
$1N132238: C342.1 U1.AF19(MIPI_D/C_PHY1_VREG)
$1N139162: R84.1 U1.AM2(HDMI/eDP_TX0_REXT)

Not connected (* = marked no-connect by the designer): U1 A24(PCIE30X1_1_CLKREQN_M2/DP0_HPDIN_M2/I2C2_SDA_M4/UART6_RX_M1/SPI4_MISO_M2/GPIO1_A0_d) A25(PCIE30X1_1_WAKEN_M2/DP1_HPDIN_M2/SATA1_ACT_LED_M1/I2C2_SCL_M4/UART6_TX_M1/SPI4_MOSI_M2/GPIO1_A1_d) A26(VOP_POST_EMPTY/I2C4_SDA_M3/UART6_RTSN_M1/PWM0_M2/SPI4_CLK_M2/GPIO1_A2_d) A27(HDMI_TX1_SDA_M2/I2C4_SCL_M3/UART6_CTSN_M1/PWM1_M2/SPI4_CS0_M2/GPIO1_A3_d) A28(PCIE30_PORT1_REF_CLKP) A30(PCIE30_PORT1_TX0N) A32(PCIE30_PORT1_RX0N) A33(PCIE30_PORT1_RESREF) AA27(HDMI_TX0_HPD_M1/PCIE30X2_PERSTN_M2/HDMI_RX_HPDIN_M1/MCU_JTAG_TCK_M1/UART9_RX_M2/SPI0_CS0_M3/GPIO3_D4_d) AA28(GMAC1_PTP_REF_CLK/HDMI_TX1_HPD_M1/I2C3_SCL_M1/SPI1_MOSI_M1/GPIO3_B7_d) AB28(PCIE30X4_BUTTON_RSTN/DP1_HPDIN_M0/MCU_JTAG_TMS_M1/UART9_TX_M2/PWM11_IR_M3/SPI0_CS1_M3/GPIO3_D5_d) AB30(GMAC0_PPSTRING/FSPI_CS1N_M1/HDMI_TX1_SCL_M0/I2C4_SCL_M1/UART7_TX_M0/GPIO2_B5_u) AB33(GMAC0_MDIO/I2C0_SCL_M1/UART9_CTSN_M0/PWM6_M2/SPI3_MOSI_M0/GPIO4_C5_d) AB34(GMAC0_MDC/I2C7_SDA_M1/UART9_RTSN_M0/PWM5_M2/SPI3_MISO_M0/GPIO4_C4_d) AC9(HDMI/eDP_TX1_AVDD_0V75) AC25(VCCIO6_1V8) AC26(VCCIO6) AC28(GMAC1_TXD0/I2S2_SDO_M1/UART2_RTSN/GPIO3_B3_u) AC29(GMAC1_TXD1/I2S2_MCLK_M1/UART2_CTSN/GPIO3_B4_u) AC30(GMAC0_PPSCLK/TEST_CLKOUT_M1/HDMI_TX1_CEC_M0/UART9_RX_M0/SPI1_CS1_M0/GPIO2_C4_d) AC34(GMAC0_TXD3/SDIO_CMD_M0/I2C3_SCL_M3/GPIO2_B2_u) AD1(SDMMC_D1/PDM1_SDI2_M0/JTAG_TMS_M1/I2C3_SDA_M4/UART2_RX_M1/PWM9_M1/GPIO4_D1_u) AD2(SDMMC_D0/PDM1_SDI3_M0/JTAG_TCK_M1/I2C3_SCL_M4/UART2_TX_M1/PWM8_M1/GPIO4_D0_u) AD3(OTP_VDDOTP_0V75) AD4(OTP_VPP) AD6(HDMI/eDP_TX1_VDD_CMN_1V8) AD7(HDMI/eDP_TX1_VDD_IO_1V8) AD9(HDMI/eDP_TX1_VDD_0V75) AD29(GMAC1_TXEN/I2S2_SCLK_TX_M1/CAN1_RX_M0/UART3_TX_M1/PWM12_M0/GPIO3_B5_u) AD30(ETH0_REFCLKO_25M/I2S2_SDI_M0/I2C6_SCL_M2/SPI1_CS0_M0/GPIO2_C3_d) AD31(GMAC0_RXD1/I2S2_LRCK_RX_M0/I2C6_SDA_M2/UART9_TX_M0/SPI1_MOSI_M0/GPIO2_C2_d) AE1(SDMMC_CLK/PDM1_CLK0_M0/TEST_CLKOUT_M0/MCU_JTAG_TMS_M0/CAN0_RX_M1/UART5_TX_M0/GPIO4_D5_d) AE2(SDMMC_CMD/PDM1_CLK1_M0/MCU_JTAG_TCK_M0/CAN0_TX_M1/UART5_RX_M0/PWM7_IR_M1/GPIO4_D4_u) AE4(HDMI_RX_VPH3V3) AE5(HDMI_RX_DVDD3V3) AE8(HDMI_RX_AVDD0V75) AE28(GMAC1_TXER/I2S2_SDI_M1/UART2_RX_M2/PWM3_IR_M1/GPIO3_B2_d) AE29(GMAC1_MCLKINOUT/I2S2_LRCK_TX_M1/CAN1_TX_M0/UART3_RX_M1/PWM13_M0/GPIO3_B6_d) AE30(CLK32K_OUT1/GPIO2_C5_d) AE31(GMAC0_RXDV_CRS/UART7_RTSN_M0/PWM2_M2/SPI3_CS0_M0/GPIO4_C2_d) AF1(SDMMC_D3/PDM1_SDI0_M0/JTAG_TMS_M0/I2C8_SDA_M0/UART5_RTSN_M0/PWM10_M1/GPIO4_D3_u) AF2(SDMMC_D2/PDM1_SDI1_M0/JTAG_TCK_M0/I2C8_SCL_M0/UART5_CTSN_M0/GPIO4_D2_u) AF3(HDMI_RX_REXT) AF5(HDMI_RX_CLKN) AF6(HDMI_RX_CLKP) AF18(TSADC_TEST_OUT_TS) AF33(GMAC0_TXER/I2C0_SDA_M1/UART7_CTSN_M0/PWM7_IR_M3/SPI3_CLK_M0/GPIO4_C6_d) AF34(GMAC0_MCLKINOUT/I2S2_SDO_M0/I2C7_SCL_M1/PWM4_M1/SPI3_CS1_M0/GPIO4_C3_d) AG1(HDMI_TX0_SBDN/eDP_TX0_AUXN)* AG2(HDMI_TX0_SBDP/eDP_TX0_AUXP)* AG4(HDMI_RX_D0N) AG5(HDMI_RX_D0P) AG9(USB20_HOST0_REXT) AG11(USB20_AVDD_1V8) AG13(TYPEC1_DP1_VDDH_1V8) AG14(TYPEC0_DP0_VDDH_1V8) AG15(AVSS_45) AG16(TYPEC1_DP1_REXT) AG23(CIF_D13/PCIE20X1_2_PERSTN_M0/HDMI_RX_CEC_M1/UART4_TX_M1/PWM9_M2/SPI0_MISO_M3/GPIO3_D1_d) AG24(CIF_D15/PCIE30X2_WAKEN_M2/HDMI_RX_SDA_M1/I2C7_SDA_M2/UART9_CTSN_M2/PWM10_M2/SPI0_CLK_M3/GPIO3_D3_d) AG25(CIF_D14/PCIE30X2_CLKREQN_M2/HDMI_RX_SCL_M1/I2C7_SCL_M2/UART9_RTSN_M2/SPI0_MOSI_M3/GPIO3_D2_d) AG26(CIF_D10/PCIE30X4_PERSTN_M2/HDMI_TX1_SCL_M1/SPI3_MISO_M3/GPIO3_C6_u) AG28(GMAC1_RXD1/I2S2_SCLK_RX_M1/MIPI_CAMERA3_CLK_M1/PWM9_M0/GPIO3_B0_u) AG29(GMAC1_RXD0/MIPI_CAMERA2_CLK_M1/PWM8_M0/GPIO3_A7_u) AH5(HDMI_RX_D1N) AH6(HDMI_RX_D1P) AH9(USB20_HOST1_REXT) AH10(USB20_DVDD_0V75) AH13(TYPEC1_DP1_VDD_0V85) AH14(TYPEC0_DP0_VDDA_0V85) AH16(TYPEC0_DP0_REXT) AH18(SARADC_AVDD_1V8) AH24(CIF_D12/PCIE20X1_2_WAKEN_M0/HDMI_TX0_SDA_M2/I2C5_SDA_M0/UART4_RX_M1/PWM8_M2/SPI3_CLK_M3/GPIO3_D0_u) AH25(CIF_D9/FSPI_CS1N_M2/PCIE30X4_WAKEN_M2/HDMI_TX1_SDA_M1/CAN2_TX_M0/UART5_RX_M1/SPI3_CS1_M3/GPIO3_C5_u) AH26(CIF_D8/FSPI_CS0N_M2/PCIE30X4_CLKREQN_M2/HDMI_TX1_CEC_M2/CAN2_RX_M0/UART5_TX_M1/SPI3_CS0_M3/GPIO3_C4_u) AH27(ETH1_REFCLKO_25M/MIPI_CAMERA1_CLK_M1/I2C4_SCL_M0/GPIO3_A6_d) AH29(GMAC1_RXDV_CRS/I2S2_LRCK_RX_M1/MIPI_CAMERA4_CLK_M1/UART2_TX_M2/PWM2_M1/GPIO3_B1_d) AJ4(HDMI_RX_D2N) AJ5(HDMI_RX_D2P) AJ10(USB20_AVDD_3V3) AJ13(TYPEC1_DP1_VDDA_0V85) AJ14(TYPEC0_DP0_VDD_0V85) AJ24(CIF_D11/PCIE20X1_2_CLKREQN_M0/HDMI_TX0_SCL_M2/I2C5_SCL_M0/SPI3_MOSI_M3/GPIO3_C7_u) AK8(TYPEC1_USB20_OTG_ID) AK9(TYPEC1_USB20_OTG_DP) AK15(SARADC_IN5) AK16(SARADC_IN2) AK17(SARADC_IN7) AK24(BT1120_D15/SPDIF1_TX_M2/PCIE20X1_2_PERSTN_M1/HDMI_TX0_CEC_M0/I2C8_SDA_M3/PWM6_M1/SPI3_CS1_M1/GPIO4_C1_d) AK25(CIF_HREF/BT1120_D8/I2S1_SDO1_M0/PCIE30X1_1_BUTTON_RSTN/I2C7_SCL_M3/UART8_RTSN_M0/PWM14_M1/SPI0_CS0_M1/CAN1_RX_M1/GPIO4_B2_u) AK26(CIF_CLKIN/BT1120_CLKOUT/I2S1_SDI3_M0/PCIE30X2_PERSTN_M1/I2C6_SDA_M3/UART8_TX_M0/SPI2_CS1_M1/GPIO4_B0_d) AK27(CIF_D5/BT1120_D5/I2S1_SDI0_M0/PCIE30X1_0_PERSTN_M1/I2C3_SDA_M2/UART3_TX_M2/SPI2_MOSI_M1/GPIO4_A5_d) AK30(CIF_D0/BT1120_D0/I2S1_MCLK_M0/PCIE30X1_1_CLKREQN_M1/UART9_RTSN_M1/SPI0_MISO_M1/GPIO4_A0_d) AL8(TYPEC1_USB20_VBUSDET) AL9(TYPEC1_USB20_OTG_DM) AL10(TYPEC1_SBU1/DP1_AUXP) AL14(TYPEC0_USB20_OTG_ID)* AL15(TYPEC0_SBU1/DP0_AUXP) AL16(SARADC_IN1) AL17(SARADC_IN6) AL24(MIPI_CAMERA0_CLK_M0/SPDIF1_TX_M1/I2S1_SDO0_M0/PCIE30X1_0_BUTTON_RSTN/SATA2_ACT_LED_M0/I2C6_SCL_M3/UART8_RX_M0/SPI0_CS1_M1/GPIO4_B1_u) AL26(CIF_CLKOUT/BT1120_D10/I2S1_SDO3_M0/PCIE30X4_CLKREQN_M1/DP0_HPDIN_M0/SPDIF0_TX_M1/UART9_TX_M1/PWM11_IR_M1/GPIO4_B4_u) AL27(CIF_D6/BT1120_D6/I2S1_SDI1_M0/PCIE30X2_CLKREQN_M1/I2C5_SCL_M2/UART3_RX_M2/SPI2_CLK_M1/GPIO4_A6_d) AL28(CIF_D4/BT1120_D4/I2S1_LRCK_RX_M0/PCIE30X1_0_WAKEN_M1/I2C3_SCL_M2/UART0_RX_M2/SPI2_MISO_M1/GPIO4_A4_d) AL29(CIF_D3/BT1120_D3/I2S1_SCLK_RX_M0/PCIE30X1_0_CLKREQN_M1/UART0_TX_M2/GPIO4_A3_d) AL30(CIF_D1/BT1120_D1/I2S1_SCLK_TX_M0/PCIE30X1_1_WAKEN_M1/UART9_CTSN_M1/SPI0_MOSI_M1/GPIO4_A1_d) AM3(HDMI_TX1_D3P/eDP_TX1_D3P) AM5(HDMI_TX1_D1P/eDP_TX1_D1P) AM10(TYPEC1_SBU2/DP1_AUXN) AM14(TYPEC0_USB20_VBUSDET) AM15(TYPEC0_SBU2/DP0_AUXN) AM16(SARADC_IN0_BOOT) AM17(SARADC_IN4) AM25(CIF_VSYNC/BT1120_D9/I2S1_SDO2_M0/PCIE20X1_2_BUTTON_RSTN/I2C7_SDA_M3/UART8_CTSN_M0/PWM15_IR_M1/CAN1_TX_M1/GPIO4_B3_u) AM27(CIF_D7/BT1120_D7/I2S1_SDI2_M0/PCIE30X2_WAKEN_M1/I2C5_SDA_M2/SPI2_CS0_M1/GPIO4_A7_d) AM28(AVSS_93) AM29(CIF_D2/BT1120_D2/I2S1_LRCK_TX_M0/PCIE30X1_1_PERSTN_M1/SPI0_CLK_M1/GPIO4_A2_d) AM31(MIPI_CSI1_CLK1P) AM32(MIPI_CSI1_CLK1N) AM33(MIPI_CSI0_CLK1P) AM34(MIPI_CSI0_CLK1N) AN1(HDMI/eDP_TX1_REXT) AN2(HDMI_TX1_SBDP/eDP_TX1_AUXP) AN3(HDMI_TX1_D3N/eDP_TX1_D3N) AN4(HDMI_TX1_D0P/eDP_TX1_D0P) AN5(HDMI_TX1_D1N/eDP_TX1_D1N) AN6(HDMI_TX1_D2P/eDP_TX1_D2P) AN8(TYPEC1_SSRX1P/DP1_TX0P) AN9(TYPEC1_SSTX1N/DP1_TX1N) AN10(TYPEC1_SSRX2P/DP1_TX2P) AN11(TYPEC1_SSTX2N/DP1_TX3N) AN13(TYPEC0_SSRX1P/DP0_TX0P) AN14(TYPEC0_SSTX1N/DP0_TX1N) AN15(TYPEC0_SSRX2P/DP0_TX2P) AN16(TYPEC0_SSTX2N/DP0_TX3N) AN17(SARADC_IN3) AN18(MIPI_DPHY1_TX_D0P/MIPI_CPHY1_TX_TRIO0_B) AN19(MIPI_DPHY1_TX_D1P/MIPI_CPHY1_TX_TRIO1_A) AN20(MIPI_DPHY1_TX_CLKP/MIPI_CPHY1_TX_TRIO1_C) AN21(MIPI_DPHY1_TX_D2P/MIPI_CPHY1_TX_TRIO2_B) AN22(MIPI_DPHY1_TX_D3P/NO_USE) AN24(MIPI_DPHY0_TX_D0P/MIPI_CPHY0_TX_TRIO0_B) AN25(MIPI_DPHY0_TX_D1P/MIPI_CPHY0_TX_TRIO1_A) AN26(MIPI_DPHY0_TX_CLKP/MIPI_CPHY0_TX_TRIO1_C) AN27(MIPI_DPHY0_TX_D2P/MIPI_CPHY0_TX_TRIO2_B) AN28(MIPI_DPHY0_TX_D3P/NO_USE) AP2(HDMI_TX1_SBDN/eDP_TX1_AUXN) AP4(HDMI_TX1_D0N/eDP_TX1_D0N) AP6(HDMI_TX1_D2N/eDP_TX1_D2N) AP7(TYPEC1_USB20_OTG1_REXT) AP8(TYPEC1_SSRX1N/DP1_TX0N) AP9(TYPEC1_SSTX1P/DP1_TX1P) AP10(TYPEC1_SSRX2N/DP1_TX2N) AP11(TYPEC1_SSTX2P/DP1_TX3P) AP12(TYPEC0_USB20_OTG0_REXT) AP13(TYPEC0_SSRX1N/DP0_TX0N) AP14(TYPEC0_SSTX1P/DP0_TX1P) AP15(TYPEC0_SSRX2N/DP0_TX2N) AP16(TYPEC0_SSTX2P/DP0_TX3P) AP18(MIPI_DPHY1_TX_D0N/MIPI_CPHY1_TX_TRIO0_A) AP19(MIPI_DPHY1_TX_D1N/MIPI_CPHY1_TX_TRIO0_C) AP20(MIPI_DPHY1_TX_CLKN/MIPI_CPHY1_TX_TRIO1_B) AP21(MIPI_DPHY1_TX_D2N/MIPI_CPHY1_TX_TRIO2_A) AP22(MIPI_DPHY1_TX_D3N/MIPI_CPHY1_TX_TRIO2_C) AP24(MIPI_DPHY0_TX_D0N/MIPI_CPHY0_TX_TRIO0_A) AP25(MIPI_DPHY0_TX_D1N/MIPI_CPHY0_TX_TRIO0_C) AP26(MIPI_DPHY0_TX_CLKN/MIPI_CPHY0_TX_TRIO1_B) AP27(MIPI_DPHY0_TX_D2N/MIPI_CPHY0_TX_TRIO2_A) AP28(MIPI_DPHY0_TX_D3N/MIPI_CPHY0_TX_TRIO2_C) B25(HDMI_TX1_SCL_M2/SPI2_MISO_M0/GPIO1_A4_d) B26(HDMI_TX0_HPD_M0/SPI2_MOSI_M0/GPIO1_A5_d) B28(PCIE30_PORT1_REF_CLKN) B29(PCIE30_PORT1_TX1N) B30(PCIE30_PORT1_TX0P) B31(PCIE30_PORT1_RX1N) B32(PCIE30_PORT1_RX0P) B34(PCIE30_PORT0_RESREF) C19(DDR_CH1_RESET_D)* C24(HDMI_TX1_HPD_M0/SPI2_CLK_M0/GPIO1_A6_d) C25(PDM1_SDI0_M1/PCIE30X1_1_PERSTN_M2/PWM3_IR_M3/SPI2_CS0_M0/GPIO1_A7_u) C27(PDM1_SDI1_M1/PCIE30X4_CLKREQN_M3/SPI2_CS1_M0/GPIO1_B0_u) C29(PCIE30_PORT1_TX1P) C31(PCIE30_PORT1_RX1P) C33(PCIE30_PORT0_TX1P) C34(PCIE30_PORT0_TX1N) D7(DDR_CH1_WCK1P_C)* D10(DDR_CH1_A6_C)* D14(DDR_CH1_A6_D)* D17(DDR_CH1_WCK0N_D)* D25(PDM1_SDI2_M1/PCIE30X4_WAKEN_M3/SPI0_MISO_M2/GPIO1_B1_d) D26(PDM1_SDI3_M1/PCIE30X4_PERSTN_M3/UART4_RX_M2/SPI0_MOSI_M2/GPIO1_B2_d) D27(PDM1_CLK1_M1/PCIE30X1_0_WAKEN_M2/SATA0_ACT_LED_M1/UART4_TX_M2/SPI0_CLK_M2/GPIO1_B3_d) D28(I2S0_SDI0/GPIO1_D4_d) D29(I2S0_LRCK_RX/PDM0_CLK0_M0/I2C4_SDA_M4/PWM15_IR_M2/GPIO1_C6_d) D30(I2S0_LRCK_TX/I2C2_SCL_M3/UART4_RTSN/GPIO1_C5_d) D32(PCIE30_PORT0_TX0P) D33(PCIE30_PORT0_TX0N) E7(DDR_CH1_WCK1N_C)* E17(DDR_CH1_WCK0P_D)* E24(PDM1_CLK0_M1/PCIE30X1_0_PERSTN_M2/UART7_RX_M2/SPI0_CS0_M2/GPIO1_B4_u) E25(PCIE30X1_0_CLKREQN_M2/UART7_TX_M2/SPI0_CS1_M2/GPIO1_B5_u) E26(MIPI_CAMERA1_CLK_M0/SPDIF0_TX_M0/PCIE30X2_WAKEN_M3/HDMI_RX_HPDIN_M2/I2C5_SCL_M3/UART1_TX_M1/GPIO1_B6_d) E27(MIPI_CAMERA2_CLK_M0/SPDIF1_TX_M0/PCIE30X2_PERSTN_M3/HDMI_RX_CEC_M2/SATA2_ACT_LED_M1/I2C5_SDA_M3/UART1_RX_M1/PWM13_M2/GPIO1_B7_u) E28(I2S0_SDI1/PDM0_SDI3_M0/I2C1_SDA_M4/UART4_RX_M0/PWM1_M1/SPI1_CS0_M2/GPIO1_D3_d) E29(I2S0_SDO0/I2C4_SCL_M4/UART4_CTSN/GPIO1_C7_d) E30(I2S0_SCLK_RX/PDM0_CLK1_M0/I2C2_SDA_M3/PWM11_IR_M2/SPI4_CS1_M0/GPIO1_C4_d) E31(I2S0_SCLK_TX/I2C6_SCL_M1/UART3_CTSN/PWM7_IR_M2/SPI4_CS0_M0/GPIO1_C3_d) E33(PCIE30_PORT0_REF_CLKP) E34(PCIE30_PORT0_REF_CLKN) F24(MIPI_CAMERA3_CLK_M0/HDMI_RX_SCL_M2/I2C8_SCL_M2/UART1_RTSN_M1/PWM14_M2/GPIO1_D6_u) F25(MIPI_CAMERA4_CLK_M0/PCIE30X2_CLKREQN_M3/HDMI_RX_SDA_M2/I2C8_SDA_M2/UART1_CTSN_M1/PWM15_IR_M3/GPIO1_D7_u) F26(I2S0_SDO1/I2C7_SCL_M0/UART6_TX_M2/SPI1_MISO_M2/GPIO1_D0_d) F27(I2S0_SDO2/I2S0_SDI3/PDM0_SDI1_M0/I2C7_SDA_M0/UART6_RX_M2/SPI1_MOSI_M2/GPIO1_D1_d) F28(I2S0_SDO3/I2S0_SDI2/PDM0_SDI2_M0/I2C1_SCL_M4/UART4_TX_M0/PWM0_M1/SPI1_CLK_M2/GPIO1_D2_d) F30(I2S0_MCLK/I2C6_SDA_M1/UART3_RTSN/PWM3_IR_M2/SPI4_CLK_M0/GPIO1_C2__d) F32(PCIE30_PORT0_RX1P) F33(PCIE30_PORT0_RX1N) G9(DDR_CH1_WCK0P_C)* G18(DDR_CH1_WCK1N_D)* G20(VCCIO1_1V8) G23(PCIE30_PORT0_AVDD1V8) G24(PCIE30_PORT0_AVDD0V75) G26(PDM0_SDI0_M0/SPI1_CS1_M2/GPIO1_D5_d) G27(I2C3_SCL_M0/UART3_TX_M0/SPI4_MOSI_M0/GPIO1_C1_z) G29(I2C3_SDA_M0/UART3_RX_M0/SPI4_MISO_M0/GPIO1_C0_z) G30(PCIE20_2_REFCLKN) G31(PCIE20_2_REFCLKP) G33(PCIE30_PORT0_RX0P) G34(PCIE30_PORT0_RX0N) H4(DDR_CH0_WCK1P_B)* H5(DDR_CH0_WCK1N_B)* H9(DDR_CH1_WCK0N_C)* H18(DDR_CH1_WCK1P_D)* H20(VCCIO4_1V8) H21(VCCIO4) H22(VSS_77) H23(PCIE30_PORT1_AVDD1V8) H24(PCIE30_PORT1_AVDD0V75) H29(PCIE20_2_TXN/SATA30_2_TXN/USB30_SSTXN) H30(PCIE20_2_TXP/SATA30_2_TXP/USB30_SSTXP) H31(AVSS_2) H32(PCIE20_1_REFCLKP) H33(PCIE20_1_REFCLKN) J30(PCIE20_2_RXN/SATA30_2_RXN/USB30_SSRXN) J31(PCIE20_2_RXP/SATA30_2_RXP/USB30_SSRXP) J33(PCIE20_1_RXP/SATA30_1_RXP) J34(PCIE20_1_RXN/SATA30_1_RXN) K4(DDR_CH0_WCK0N_B)* K5(DDR_CH0_WCK0P_B)* K7(DDR_CH0_RESET_B)* K27(PCIE20_SATA30_USB30_2_AVDD_1V8) K28(PCIE20_SATA30_USB30_2_AVDD_0V85) K33(PCIE20_1_TXP/SATA30_1_TXP) K34(PCIE20_1_TXN/SATA30_1_TXN) L27(PCIE20_SATA30_1_AVDD_1V8) L28(PCIE20_SATA30_1_AVDD_0V85) L30(SPI2_CS1_M2/I2C1_SCL_M1/UART0_RX_M1/GPIO0_B0_z) L32(PCIE20_0_REFCLKP) L33(PCIE20_0_REFCLKN) M7(DDR_CH0_A6_B)* M27(PCIE20_SATA30_0_AVDD_1V8) M28(PCIE20_SATA30_0_AVDD_0V85) M33(PCIE20_0_TXN/SATA30_0_TXN)* M34(PCIE20_0_TXP/SATA30_0_TXP)* N33(PCIE20_0_RXP/SATA30_0_RXP)* N34(PCIE20_0_RXN/SATA30_0_RXN)* P29(I2S1_MCLK_M1/JTAG_TCK_M2/I2C1_SCL_M0/UART2_TX_M0/PCIE30X1_1_CLKREQN_M0/GPIO0_B5_d) P31(SDMMC_DET/GPIO0_A4_u) P33(REFCLK_OUT/GPIO0_A0_d) R29(I2S1_SCLK_TX_M1/JTAG_TMS_M2/I2C1_SDA_M0/UART2_RX_M0/PCIE30X1_1_WAKEN_M0/GPIO0_B6_d) T5(DDR_CH0_A6_A)* T28(I2S1_LRCK_TX_M1/PWM0_M0/I2C2_SCL_M0/CAN0_TX_M0/SPI0_CS1_M0/PCIE30X1_1_PERSTN_M0/GPIO0_B7_d) T29(I2S1_SDI1_M1/NPU_AVS/UART0_RTSN/PWM5_M1/SPI0_CLK_M0/PCIE30X4_CLKREQN_M0/SATA_CP_POD/GPIO0_C6_u) T31(I2S1_SCLK_RX_M1/PDM0_CLK0_M1/PWM1_M0/I2C2_SDA_M0/CAN0_RX_M0/SPI0_MOSI_M0/PCIE30X1_0_CLKREQN_M0/GPIO0_C0_d) U33(LITCPU_AVS/SPI3_CLK_M2/GPIO0_D3_u) V6(DDR_CH0_WCK0N_A)* V7(DDR_CH0_WCK0P_A)* V28(I2S1_SDO3_M1/CPU_BIG1_AVS/I2C1_SDA_M2/CAN2_TX_M1/HDMI_TX0_SCL_M1/SPI3_CS1_M2/SATA_MP_SWITCH/GPIO0_D5_u)* V29(I2S1_SDO2_M1/PDM0_SDI2_M1/PWM3_IR_M0/I2C1_SCL_M2/CAN2_RX_M1/HDMI_TX0_SDA_M1/SPI3_CS0_M2/PCIE30X2_PERSTN_M0/SATA_CPDET/GPIO0_D4_u)* V31(I2S1_SDI2_M1/PDM0_SDI0_M1/I2C6_SDA_M0/UART1_RTSN_M2/PWM6_M0/SPI0_MISO_M0/PCIE30X4_WAKEN_M0/GPIO0_C7_d)* W4(DDR_CH0_WCK1P_A)* W5(DDR_CH0_WCK1N_A)* W25(VCCIO5_1V8) W26(VCCIO5) W29(I2S1_SDO1_M1/I2C0_SDA_M2/UART1_RX_M2/HDMI_RX_SCL_M0/SPI3_MOSI_M2/PCIE30X2_WAKEN_M0/HDMI_TX1_CEC_M1/GPIO0_D2_u) W30(I2S1_SDO0_M1/CPU_BIG0_AVS/I2C0_SCL_M2/UART0_CTSN/UART1_TX_M2/HDMI_RX_SDA_M0/SPI0_CS0_M0/PCIE30X2_CLKREQN_M0/HDMI_TX0_CEC_M1/GPIO0_D1_u) W31(I2S1_SDI3_M1/PDM0_SDI1_M1/I2C6_SCL_M0/UART1_CTSN_M2/PWM7_IR_M0/SPI3_MISO_M2/PCIE30X4_PERSTN_M0/GPIO0_D0_d) Y26(VCCIO3_1V8) Y27(GMAC1_PPSCLK/PCIE30X2_BUTTON_RSTN/UART7_RX_M1/SPI1_CLK_M1/GPIO3_C1_d) Y29(GMAC1_PPSTRIG/I2C3_SDA_M1/UART7_TX_M1/SPI1_MISO_M1/GPIO3_C0_d) Y30(GMAC1_MDIO/MIPI_TE1/I2C8_SDA_M4/UART7_CTSN_M1/PWM15_IR_M0/SPI1_CS1_M1/GPIO3_C3_d) Y31(GMAC1_MDC/MIPI_TE0/I2C8_SCL_M4/UART7_RTSN_M1/PWM14_M0/SPI1_CS0_M1/GPIO3_C2_d)

## Notes on the sheets
sheet 1
- RK3588_SoC
